# EAGLE schematic UhrV1.1 (EAGLE 5.11)

## Sheet 1 of 3
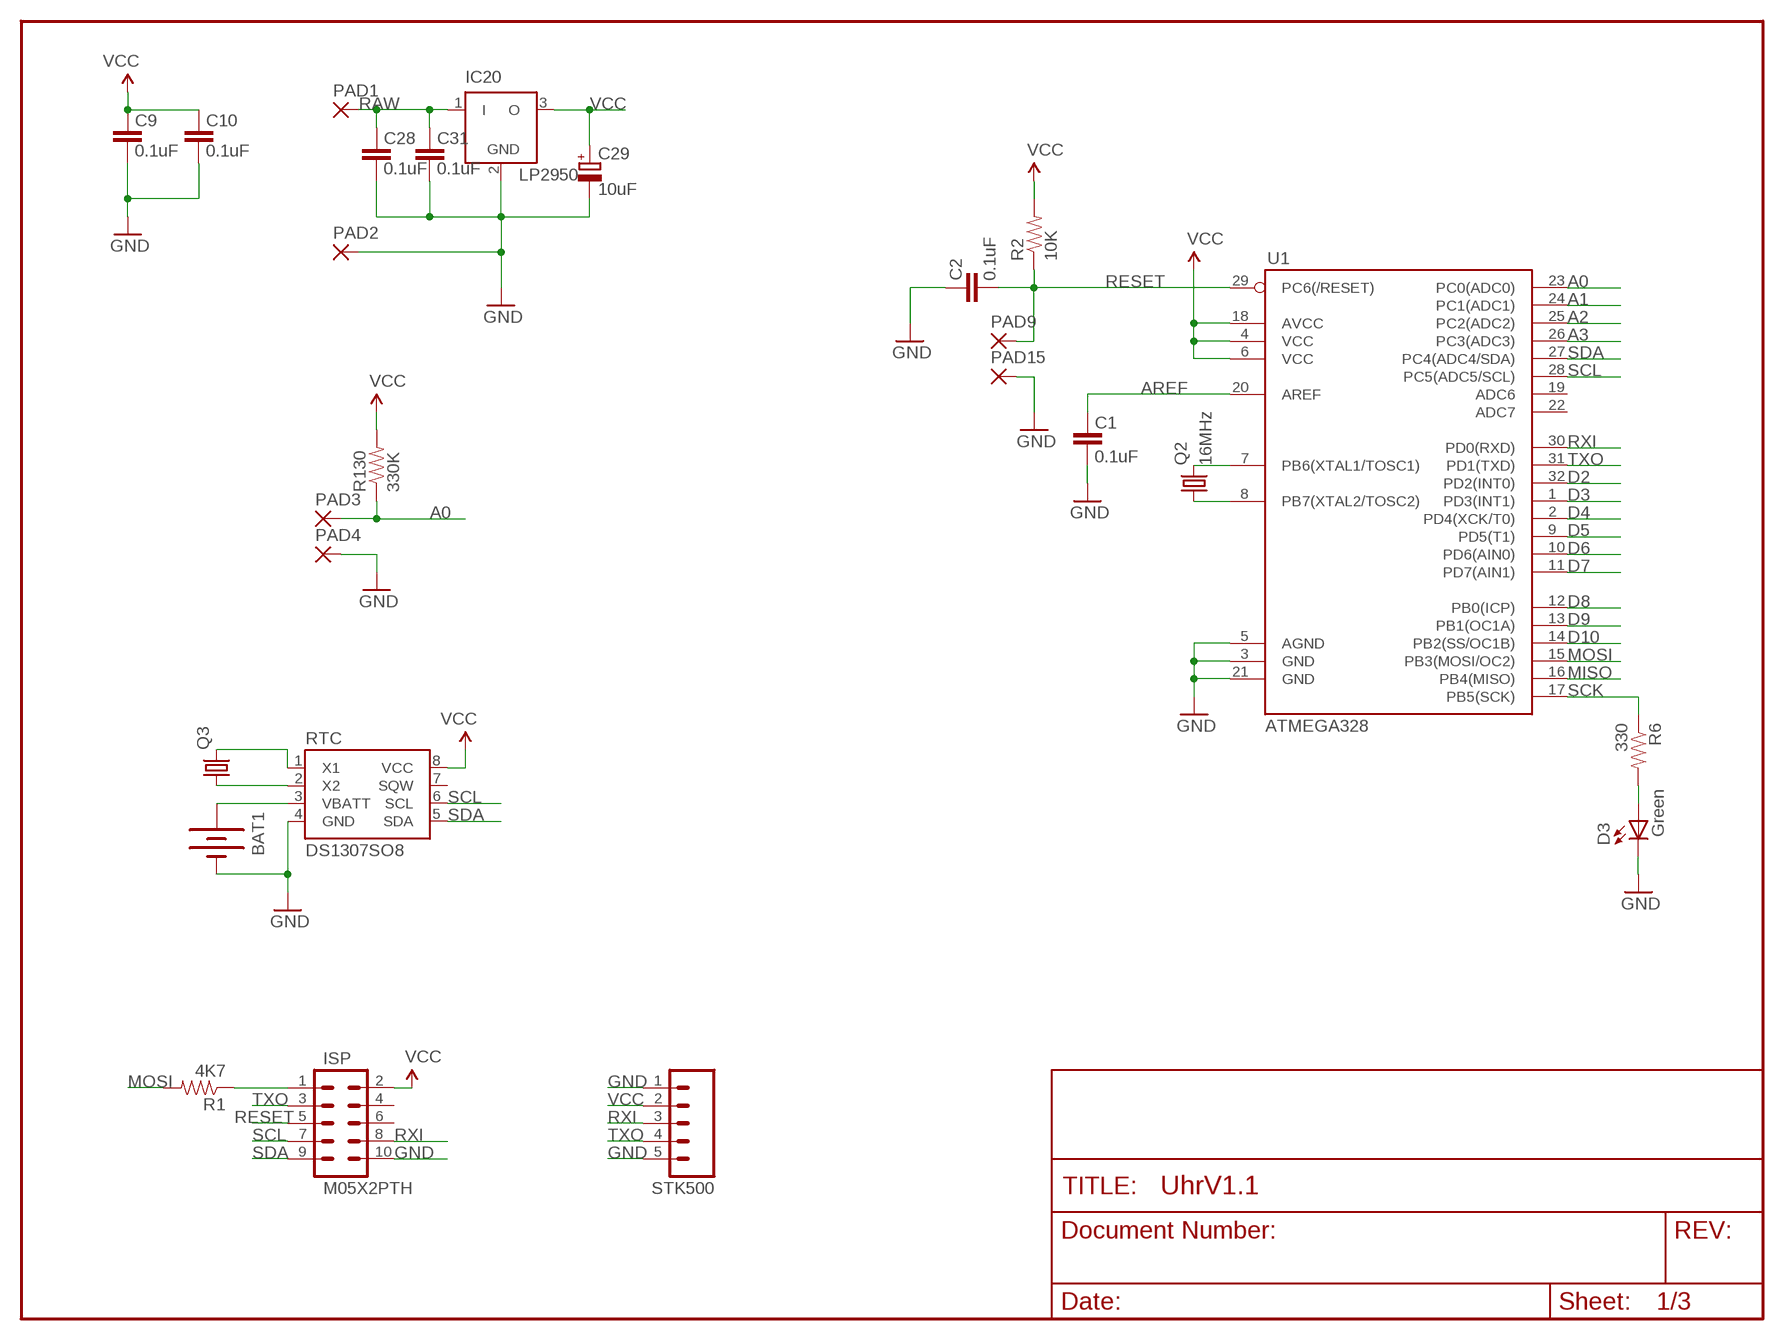
[diagram p0: schematic, sheet 1]

### Parts
BAT1  BATTERY12MM  [BATTCON_12MM]
C1  0.1uF  CAP0805  [0805]
C2  0.1uF  CAP0805  [0805]
C9  0.1uF  CAP0805  [0805]
C10  0.1uF  CAP0805  [0805]
C28  0.1uF  CAP0805  [0805]
C29  10uF  CPOL-EUB  [PANASONIC_B]
C31  0.1uF  CAP0805  [0805]
D3  Green  LED0603  [LED-0603]
IC20  LP2950  [DPACK]
ISP  M05X2PTH  [AVR_ICSP]
PAD1  SMD5  [SMD2,54-5,08]
PAD2  SMD5  [SMD2,54-5,08]
PAD3  SMD2  [SMD1,27-2,54]
PAD4  SMD2  [SMD1,27-2,54]
PAD9  SMD2  [SMD1,27-2,54]
PAD15  SMD2  [SMD1,27-2,54]
Q2  16MHz  CRYSTALHC49UP  [HC49UP]
Q3  CRYSTALTC38H  [TC38H]
R1  4K7  RESISTOR0805-RES  [0805]
R2  10K  RESISTOR0805-RES  [0805]
R6  330  RESISTOR0805-RES  [0805]
R130  330K  RESISTOR0805-RES  [0805]
RTC  DS1307SO8  [SO08]
STK500  M05PTH  [1X05]
U1  ATMEGA328  ATMEGA168  [TQFP32-08]

### Nets
A0: PAD3.1(P) R130.1 U1.23(PC0(ADC0))
A1: U1.24(PC1(ADC1))
A2: U1.25(PC2(ADC2))
A3: U1.26(PC3(ADC3))
AREF: C1.2 U1.20(AREF)
D2: U1.32(PD2(INT0)) ; also sheet 2
D3: U1.1(PD3(INT1)) ; also sheet 2
D4: U1.2(PD4(XCK/T0)) ; also sheet 2
D5: U1.9(PD5(T1)) ; also sheet 2
D6: U1.10(PD6(AIN0)) ; also sheet 3
D7: U1.11(PD7(AIN1)) ; also sheet 3
D8: U1.12(PB0(ICP)) ; also sheet 3
D9: U1.13(PB1(OC1A)) ; also sheet 3
D10: U1.14(PB2(SS/OC1B))
GND [supply]: BAT1.GND(-) C1.1 C2.2 C9.1 C10.1 C28.1 C29.- C31.1 D3.C IC20.2(GND) ISP.10 PAD2.1(P) PAD4.1(P) PAD15.1(P) RTC.4(GND) STK500.1 STK500.5 U1.3(GND) U1.5(AGND) U1.21(GND) ; also sheet 2,3
MISO: U1.16(PB4(MISO))
MOSI: R1.2 U1.15(PB3(MOSI/OC2))
N$1: Q2.1 U1.8(PB7(XTAL2/TOSC2))
N$2: Q2.2 U1.7(PB6(XTAL1/TOSC1))
N$3: ISP.1 R1.1
N$4: Q3.1 RTC.2(X2)
N$5: Q3.2 RTC.1(X1)
N$6: BAT1.PWR@1(+) RTC.3(VBATT)
N$7: D3.A R6.2
RAW [supply]: C28.2 C31.2 IC20.1(I) PAD1.1(P)
RESET: C2.1 ISP.5 PAD9.1(P) R2.1 U1.29(PC6(/RESET))
RXI: ISP.8 STK500.3 U1.30(PD0(RXD))
SCK: R6.1 U1.17(PB5(SCK))
SCL: ISP.7 RTC.6(SCL) U1.28(PC5(ADC5/SCL))
SDA: ISP.9 RTC.5(SDA) U1.27(PC4(ADC4/SDA))
TXO: ISP.3 STK500.4 U1.31(PD1(TXD))
VCC [supply]: C9.2 C10.2 C29.+ IC20.3(O) ISP.2 R2.2 R130.2 RTC.8(VCC) STK500.2 U1.4(VCC) U1.6(VCC) U1.18(AVCC) ; also sheet 2,3
Unconnected: ISP.4 ISP.6 RTC.7(SQW) U1.19(ADC6) U1.22(ADC7)

## Sheet 2 of 3
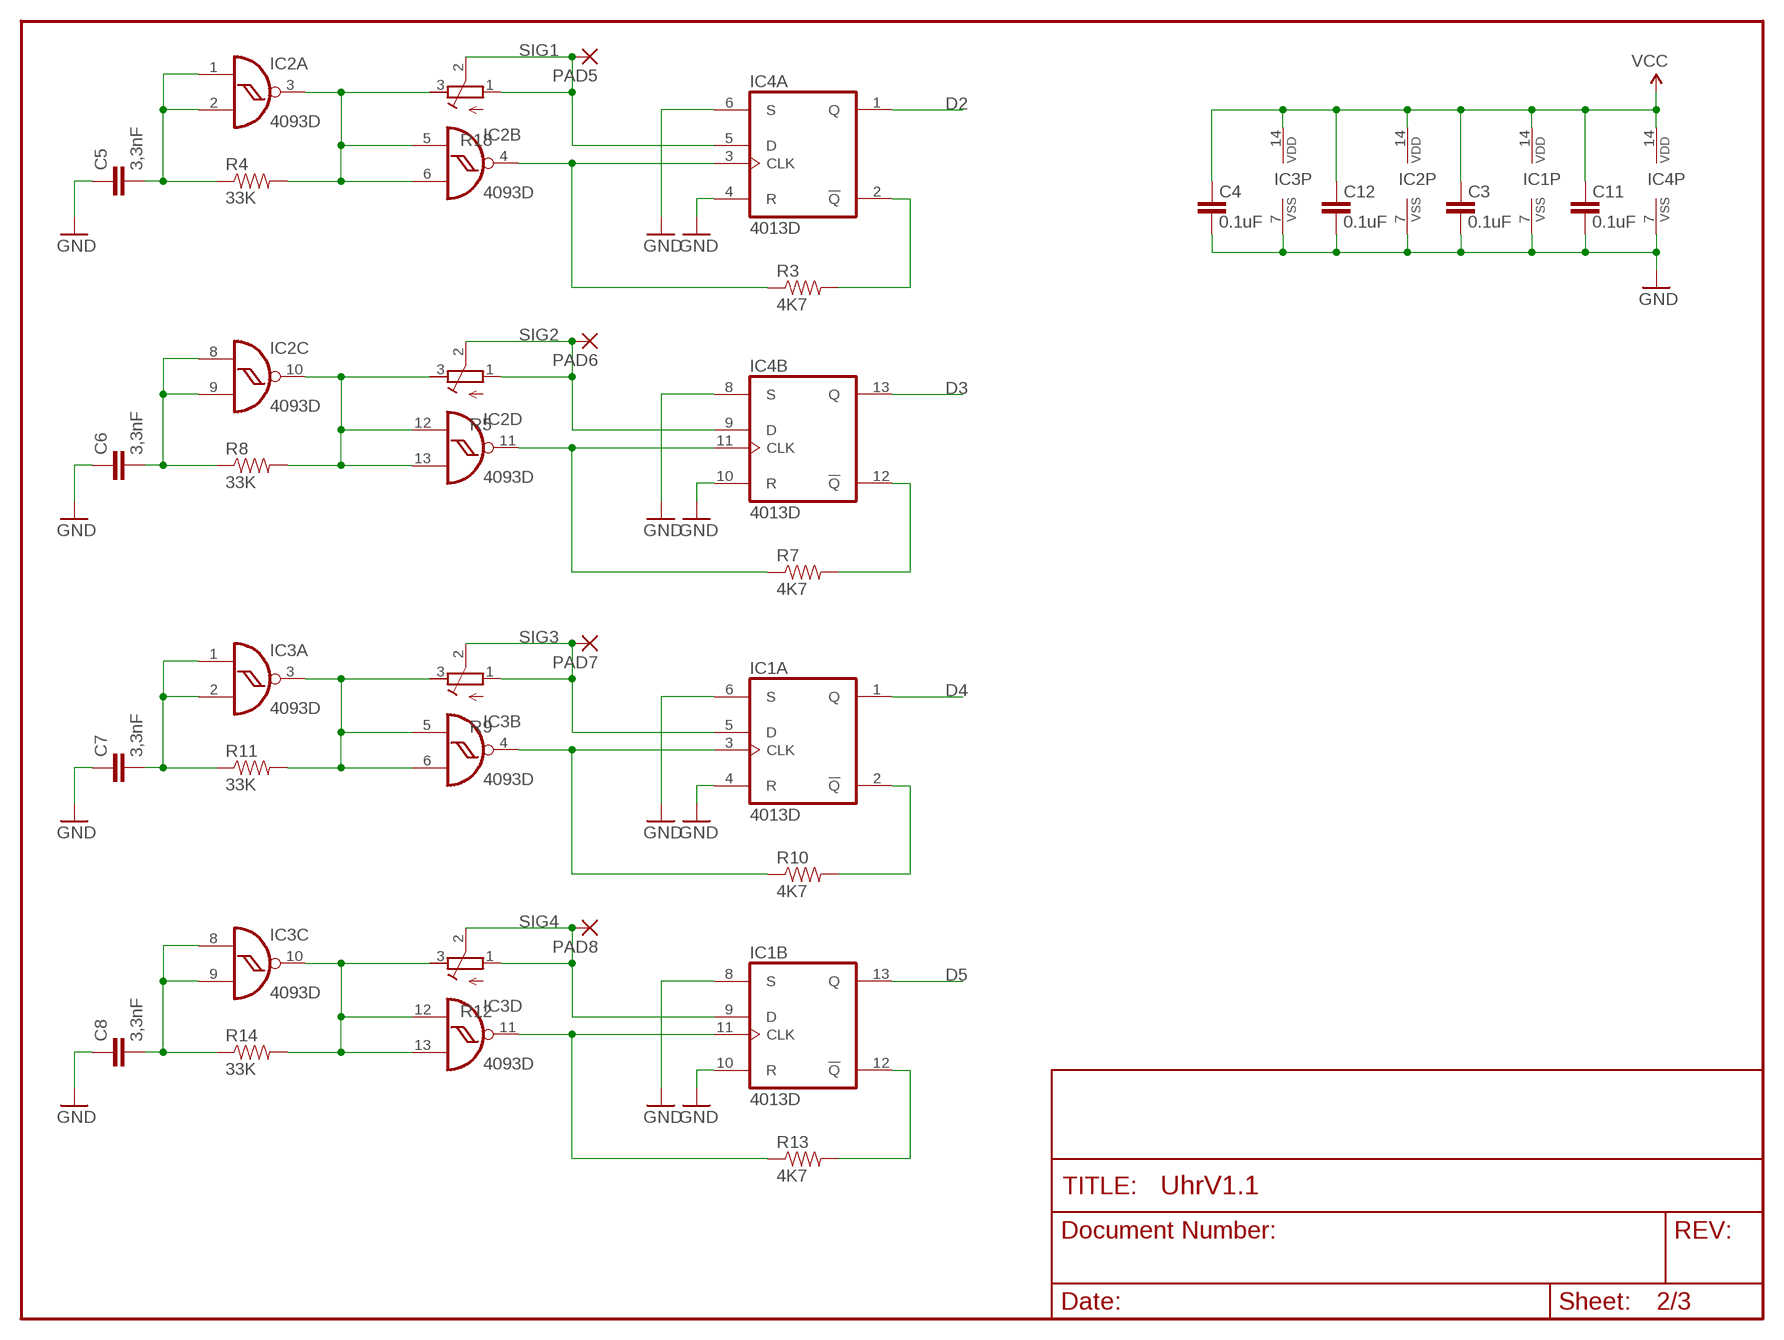
[diagram p1: schematic, sheet 2]

### Parts
C3  0.1uF  CAP0805  [0805]
C4  0.1uF  CAP0805  [0805]
C5  3,3nF  CAP0805  [0805]
C6  3,3nF  CAP0805  [0805]
C7  3,3nF  CAP0805  [0805]
C8  3,3nF  CAP0805  [0805]
C11  0.1uF  CAP0805  [0805]
C12  0.1uF  CAP0805  [0805]
IC1  4013D  [SO14]
IC2  4093D  [SO14]
IC3  4093D  [SO14]
IC4  4013D  [SO14]
PAD5  SMD2  [SMD1,27-2,54]
PAD6  SMD2  [SMD1,27-2,54]
PAD7  SMD2  [SMD1,27-2,54]
PAD8  SMD2  [SMD1,27-2,54]
R3  4K7  RESISTOR0805-RES  [0805]
R4  33K  RESISTOR0805-RES  [0805]
R5  R-TRIMM3314J  [RTRIM3314J]
R7  4K7  RESISTOR0805-RES  [0805]
R8  33K  RESISTOR0805-RES  [0805]
R9  R-TRIMM3314J  [RTRIM3314J]
R10  4K7  RESISTOR0805-RES  [0805]
R11  33K  RESISTOR0805-RES  [0805]
R12  R-TRIMM3314J  [RTRIM3314J]
R13  4K7  RESISTOR0805-RES  [0805]
R14  33K  RESISTOR0805-RES  [0805]
R18  R-TRIMM3314J  [RTRIM3314J]

### Nets
D2: IC4.1(A:Q) ; also sheet 1
D3: IC4.13(B:Q) ; also sheet 1
D4: IC1.1(A:Q) ; also sheet 1
D5: IC1.13(B:Q) ; also sheet 1
GND [supply]: C3.1 C4.1 C5.1 C6.1 C7.1 C8.1 C11.1 C12.1 IC1.4(A:R) IC1.6(A:S) IC1.7(P:VSS) IC1.8(B:S) IC1.10(B:R) IC2.7(P:VSS) IC3.7(P:VSS) IC4.4(A:R) IC4.6(A:S) IC4.7(P:VSS) IC4.8(B:S) IC4.10(B:R) ; also sheet 1,3
N$8: IC2.4(B:O) IC4.3(A:CLK) R3.1
N$9: IC4.2(A:!Q) R3.2
N$11: IC2.3(A:O) IC2.5(B:I0) IC2.6(B:I1) R4.2 R18.3(A)
N$12: IC1.3(A:CLK) IC3.4(B:O) R10.1
N$13: C5.2 IC2.1(A:I0) IC2.2(A:I1) R4.1
N$15: IC2.11(D:O) IC4.11(B:CLK) R7.1
N$16: IC4.12(B:!Q) R7.2
N$17: IC2.10(C:O) IC2.12(D:I0) IC2.13(D:I1) R5.3(A) R8.2
N$18: C6.2 IC2.8(C:I0) IC2.9(C:I1) R8.1
N$21: IC1.2(A:!Q) R10.2
N$22: IC3.3(A:O) IC3.5(B:I0) IC3.6(B:I1) R9.3(A) R11.2
N$23: C7.2 IC3.1(A:I0) IC3.2(A:I1) R11.1
N$26: IC1.11(B:CLK) IC3.11(D:O) R13.1
N$27: IC1.12(B:!Q) R13.2
N$28: IC3.10(C:O) IC3.12(D:I0) IC3.13(D:I1) R12.3(A) R14.2
N$29: C8.2 IC3.8(C:I0) IC3.9(C:I1) R14.1
SIG1: IC4.5(A:D) PAD5.1(P) R18.1(E) R18.2(S)
SIG2: IC4.9(B:D) PAD6.1(P) R5.1(E) R5.2(S)
SIG3: IC1.5(A:D) PAD7.1(P) R9.1(E) R9.2(S)
SIG4: IC1.9(B:D) PAD8.1(P) R12.1(E) R12.2(S)
VCC [supply]: C3.2 C4.2 C11.2 C12.2 IC1.14(P:VDD) IC2.14(P:VDD) IC3.14(P:VDD) IC4.14(P:VDD) ; also sheet 1,3

## Sheet 3 of 3
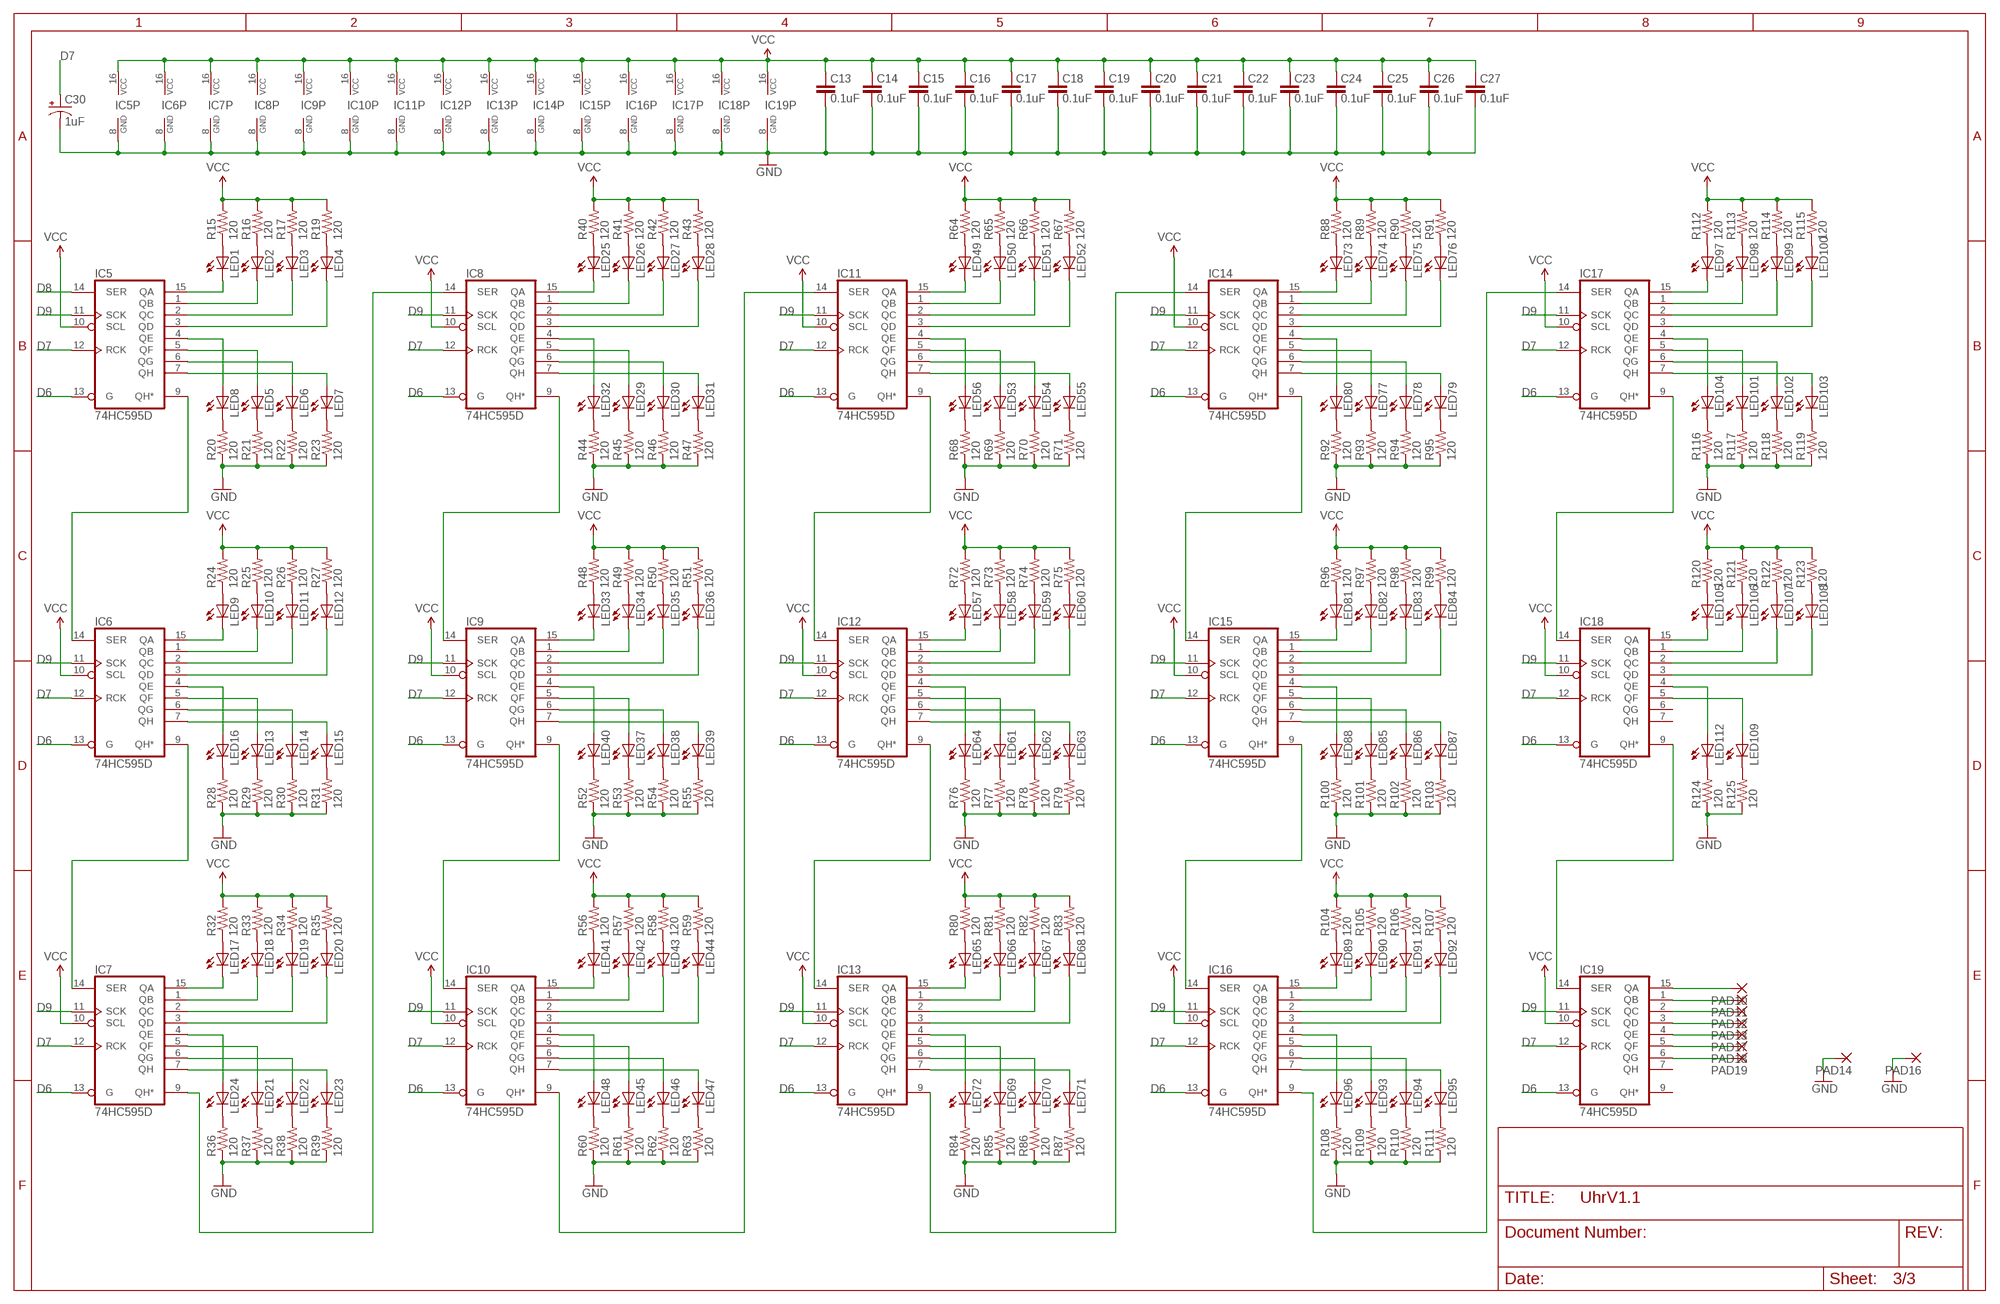
[diagram p2: schematic, sheet 3]

### Parts
C13  0.1uF  CAP0805  [0805]
C14  0.1uF  CAP0805  [0805]
C15  0.1uF  CAP0805  [0805]
C16  0.1uF  CAP0805  [0805]
C17  0.1uF  CAP0805  [0805]
C18  0.1uF  CAP0805  [0805]
C19  0.1uF  CAP0805  [0805]
C20  0.1uF  CAP0805  [0805]
C21  0.1uF  CAP0805  [0805]
C22  0.1uF  CAP0805  [0805]
C23  0.1uF  CAP0805  [0805]
C24  0.1uF  CAP0805  [0805]
C25  0.1uF  CAP0805  [0805]
C26  0.1uF  CAP0805  [0805]
C27  0.1uF  CAP0805  [0805]
C30  1uF  CAP_POL1206  [EIA3216]
IC5  74HC595D  [SO16]
IC6  74HC595D  [SO16]
IC7  74HC595D  [SO16]
IC8  74HC595D  [SO16]
IC9  74HC595D  [SO16]
IC10  74HC595D  [SO16]
IC11  74HC595D  [SO16]
IC12  74HC595D  [SO16]
IC13  74HC595D  [SO16]
IC14  74HC595D  [SO16]
IC15  74HC595D  [SO16]
IC16  74HC595D  [SO16]
IC17  74HC595D  [SO16]
IC18  74HC595D  [SO16]
IC19  74HC595D  [SO16]
LED1  LEDSMT1206  [1206]
LED2  LEDSMT1206  [1206]
LED3  LEDSMT1206  [1206]
LED4  LEDSMT1206  [1206]
LED5  LEDSMT1206  [1206]
LED6  LEDSMT1206  [1206]
LED7  LEDSMT1206  [1206]
LED8  LEDSMT1206  [1206]
LED9  LEDSMT1206  [1206]
LED10  LEDSMT1206  [1206]
LED11  LEDSMT1206  [1206]
LED12  LEDSMT1206  [1206]
LED13  LEDSMT1206  [1206]
LED14  LEDSMT1206  [1206]
LED15  LEDSMT1206  [1206]
LED16  LEDSMT1206  [1206]
LED17  LEDSMT1206  [1206]
LED18  LEDSMT1206  [1206]
LED19  LEDSMT1206  [1206]
LED20  LEDSMT1206  [1206]
LED21  LEDSMT1206  [1206]
LED22  LEDSMT1206  [1206]
LED23  LEDSMT1206  [1206]
LED24  LEDSMT1206  [1206]
LED25  LEDSMT1206  [1206]
LED26  LEDSMT1206  [1206]
LED27  LEDSMT1206  [1206]
LED28  LEDSMT1206  [1206]
LED29  LEDSMT1206  [1206]
LED30  LEDSMT1206  [1206]
LED31  LEDSMT1206  [1206]
LED32  LEDSMT1206  [1206]
LED33  LEDSMT1206  [1206]
LED34  LEDSMT1206  [1206]
LED35  LEDSMT1206  [1206]
LED36  LEDSMT1206  [1206]
LED37  LEDSMT1206  [1206]
LED38  LEDSMT1206  [1206]
LED39  LEDSMT1206  [1206]
LED40  LEDSMT1206  [1206]
LED41  LEDSMT1206  [1206]
LED42  LEDSMT1206  [1206]
LED43  LEDSMT1206  [1206]
LED44  LEDSMT1206  [1206]
LED45  LEDSMT1206  [1206]
LED46  LEDSMT1206  [1206]
LED47  LEDSMT1206  [1206]
LED48  LEDSMT1206  [1206]
LED49  LEDSMT1206  [1206]
LED50  LEDSMT1206  [1206]
LED51  LEDSMT1206  [1206]
LED52  LEDSMT1206  [1206]
LED53  LEDSMT1206  [1206]
LED54  LEDSMT1206  [1206]
LED55  LEDSMT1206  [1206]
LED56  LEDSMT1206  [1206]
LED57  LEDSMT1206  [1206]
LED58  LEDSMT1206  [1206]
LED59  LEDSMT1206  [1206]
LED60  LEDSMT1206  [1206]
LED61  LEDSMT1206  [1206]
LED62  LEDSMT1206  [1206]
LED63  LEDSMT1206  [1206]
LED64  LEDSMT1206  [1206]
LED65  LEDSMT1206  [1206]
LED66  LEDSMT1206  [1206]
LED67  LEDSMT1206  [1206]
LED68  LEDSMT1206  [1206]
LED69  LEDSMT1206  [1206]
LED70  LEDSMT1206  [1206]
LED71  LEDSMT1206  [1206]
LED72  LEDSMT1206  [1206]
LED73  LEDSMT1206  [1206]
LED74  LEDSMT1206  [1206]
LED75  LEDSMT1206  [1206]
LED76  LEDSMT1206  [1206]
LED77  LEDSMT1206  [1206]
LED78  LEDSMT1206  [1206]
LED79  LEDSMT1206  [1206]
LED80  LEDSMT1206  [1206]
LED81  LEDSMT1206  [1206]
LED82  LEDSMT1206  [1206]
LED83  LEDSMT1206  [1206]
LED84  LEDSMT1206  [1206]
LED85  LEDSMT1206  [1206]
LED86  LEDSMT1206  [1206]
LED87  LEDSMT1206  [1206]
LED88  LEDSMT1206  [1206]
LED89  LEDSMT1206  [1206]
LED90  LEDSMT1206  [1206]
LED91  LEDSMT1206  [1206]
LED92  LEDSMT1206  [1206]
LED93  LEDSMT1206  [1206]
LED94  LEDSMT1206  [1206]
LED95  LEDSMT1206  [1206]
LED96  LEDSMT1206  [1206]
LED97  LEDSMT1206  [1206]
LED98  LEDSMT1206  [1206]
LED99  LEDSMT1206  [1206]
LED100  LEDSMT1206  [1206]
LED101  LEDSMT1206  [1206]
LED102  LEDSMT1206  [1206]
LED103  LEDSMT1206  [1206]
LED104  LEDSMT1206  [1206]
LED105  LEDSMT1206  [1206]
LED106  LEDSMT1206  [1206]
LED107  LEDSMT1206  [1206]
LED108  LEDSMT1206  [1206]
LED109  LEDSMT1206  [1206]
LED112  LEDSMT1206  [1206]
PAD10  SMD2  [SMD1,27-2,54]
PAD11  SMD2  [SMD1,27-2,54]
PAD12  SMD2  [SMD1,27-2,54]
PAD13  SMD2  [SMD1,27-2,54]
PAD14  SMD2  [SMD1,27-2,54]
PAD16  SMD2  [SMD1,27-2,54]
PAD17  SMD2  [SMD1,27-2,54]
PAD18  SMD2  [SMD1,27-2,54]
PAD19  SMD2  [SMD1,27-2,54]
R15  120  RESISTOR0805-RES  [0805]
R16  120  RESISTOR0805-RES  [0805]
R17  120  RESISTOR0805-RES  [0805]
R19  120  RESISTOR0805-RES  [0805]
R20  120  RESISTOR0805-RES  [0805]
R21  120  RESISTOR0805-RES  [0805]
R22  120  RESISTOR0805-RES  [0805]
R23  120  RESISTOR0805-RES  [0805]
R24  120  RESISTOR0805-RES  [0805]
R25  120  RESISTOR0805-RES  [0805]
R26  120  RESISTOR0805-RES  [0805]
R27  120  RESISTOR0805-RES  [0805]
R28  120  RESISTOR0805-RES  [0805]
R29  120  RESISTOR0805-RES  [0805]
R30  120  RESISTOR0805-RES  [0805]
R31  120  RESISTOR0805-RES  [0805]
R32  120  RESISTOR0805-RES  [0805]
R33  120  RESISTOR0805-RES  [0805]
R34  120  RESISTOR0805-RES  [0805]
R35  120  RESISTOR0805-RES  [0805]
R36  120  RESISTOR0805-RES  [0805]
R37  120  RESISTOR0805-RES  [0805]
R38  120  RESISTOR0805-RES  [0805]
R39  120  RESISTOR0805-RES  [0805]
R40  120  RESISTOR0805-RES  [0805]
R41  120  RESISTOR0805-RES  [0805]
R42  120  RESISTOR0805-RES  [0805]
R43  120  RESISTOR0805-RES  [0805]
R44  120  RESISTOR0805-RES  [0805]
R45  120  RESISTOR0805-RES  [0805]
R46  120  RESISTOR0805-RES  [0805]
R47  120  RESISTOR0805-RES  [0805]
R48  120  RESISTOR0805-RES  [0805]
R49  120  RESISTOR0805-RES  [0805]
R50  120  RESISTOR0805-RES  [0805]
R51  120  RESISTOR0805-RES  [0805]
R52  120  RESISTOR0805-RES  [0805]
R53  120  RESISTOR0805-RES  [0805]
R54  120  RESISTOR0805-RES  [0805]
R55  120  RESISTOR0805-RES  [0805]
R56  120  RESISTOR0805-RES  [0805]
R57  120  RESISTOR0805-RES  [0805]
R58  120  RESISTOR0805-RES  [0805]
R59  120  RESISTOR0805-RES  [0805]
R60  120  RESISTOR0805-RES  [0805]
R61  120  RESISTOR0805-RES  [0805]
R62  120  RESISTOR0805-RES  [0805]
R63  120  RESISTOR0805-RES  [0805]
R64  120  RESISTOR0805-RES  [0805]
R65  120  RESISTOR0805-RES  [0805]
R66  120  RESISTOR0805-RES  [0805]
R67  120  RESISTOR0805-RES  [0805]
R68  120  RESISTOR0805-RES  [0805]
R69  120  RESISTOR0805-RES  [0805]
R70  120  RESISTOR0805-RES  [0805]
R71  120  RESISTOR0805-RES  [0805]
R72  120  RESISTOR0805-RES  [0805]
R73  120  RESISTOR0805-RES  [0805]
R74  120  RESISTOR0805-RES  [0805]
R75  120  RESISTOR0805-RES  [0805]
R76  120  RESISTOR0805-RES  [0805]
R77  120  RESISTOR0805-RES  [0805]
R78  120  RESISTOR0805-RES  [0805]
R79  120  RESISTOR0805-RES  [0805]
R80  120  RESISTOR0805-RES  [0805]
R81  120  RESISTOR0805-RES  [0805]
R82  120  RESISTOR0805-RES  [0805]
R83  120  RESISTOR0805-RES  [0805]
R84  120  RESISTOR0805-RES  [0805]
R85  120  RESISTOR0805-RES  [0805]
R86  120  RESISTOR0805-RES  [0805]
R87  120  RESISTOR0805-RES  [0805]
R88  120  RESISTOR0805-RES  [0805]
R89  120  RESISTOR0805-RES  [0805]
R90  120  RESISTOR0805-RES  [0805]
R91  120  RESISTOR0805-RES  [0805]
R92  120  RESISTOR0805-RES  [0805]
R93  120  RESISTOR0805-RES  [0805]
R94  120  RESISTOR0805-RES  [0805]
R95  120  RESISTOR0805-RES  [0805]
R96  120  RESISTOR0805-RES  [0805]
R97  120  RESISTOR0805-RES  [0805]
R98  120  RESISTOR0805-RES  [0805]
R99  120  RESISTOR0805-RES  [0805]
R100  120  RESISTOR0805-RES  [0805]
R101  120  RESISTOR0805-RES  [0805]
R102  120  RESISTOR0805-RES  [0805]
R103  120  RESISTOR0805-RES  [0805]
R104  120  RESISTOR0805-RES  [0805]
R105  120  RESISTOR0805-RES  [0805]
R106  120  RESISTOR0805-RES  [0805]
R107  120  RESISTOR0805-RES  [0805]
R108  120  RESISTOR0805-RES  [0805]
R109  120  RESISTOR0805-RES  [0805]
R110  120  RESISTOR0805-RES  [0805]
R111  120  RESISTOR0805-RES  [0805]
R112  120  RESISTOR0805-RES  [0805]
R113  120  RESISTOR0805-RES  [0805]
R114  120  RESISTOR0805-RES  [0805]
R115  120  RESISTOR0805-RES  [0805]
R116  120  RESISTOR0805-RES  [0805]
R117  120  RESISTOR0805-RES  [0805]
R118  120  RESISTOR0805-RES  [0805]
R119  120  RESISTOR0805-RES  [0805]
R120  120  RESISTOR0805-RES  [0805]
R121  120  RESISTOR0805-RES  [0805]
R122  120  RESISTOR0805-RES  [0805]
R123  120  RESISTOR0805-RES  [0805]
R124  120  RESISTOR0805-RES  [0805]
R125  120  RESISTOR0805-RES  [0805]

### Nets
D6: IC5.13(G) IC6.13(G) IC7.13(G) IC8.13(G) IC9.13(G) IC10.13(G) IC11.13(G) IC12.13(G) IC13.13(G) IC14.13(G) IC15.13(G) IC16.13(G) IC17.13(G) IC18.13(G) IC19.13(G) ; also sheet 1
D7: C30.A(+) IC5.12(RCK) IC6.12(RCK) IC7.12(RCK) IC8.12(RCK) IC9.12(RCK) IC10.12(RCK) IC11.12(RCK) IC12.12(RCK) IC13.12(RCK) IC14.12(RCK) IC15.12(RCK) IC16.12(RCK) IC17.12(RCK) IC18.12(RCK) IC19.12(RCK) ; also sheet 1
D8: IC5.14(SER) ; also sheet 1
D9: IC5.11(SCK) IC6.11(SCK) IC7.11(SCK) IC8.11(SCK) IC9.11(SCK) IC10.11(SCK) IC11.11(SCK) IC12.11(SCK) IC13.11(SCK) IC14.11(SCK) IC15.11(SCK) IC16.11(SCK) IC17.11(SCK) IC18.11(SCK) IC19.11(SCK) ; also sheet 1
GND [supply]: C13.1 C14.1 C15.1 C16.1 C17.1 C18.1 C19.1 C20.1 C21.1 C22.1 C23.1 C24.1 C25.1 C26.1 C27.1 C30.C(-) IC5.8(GND) IC6.8(GND) IC7.8(GND) IC8.8(GND) IC9.8(GND) IC10.8(GND) IC11.8(GND) IC12.8(GND) IC13.8(GND) IC14.8(GND) IC15.8(GND) IC16.8(GND) IC17.8(GND) IC18.8(GND) IC19.8(GND) PAD14.1(P) PAD16.1(P) R20.1 R21.1 R22.1 R23.1 R28.1 R29.1 R30.1 R31.1 R36.1 R37.1 R38.1 R39.1 R44.1 R45.1 R46.1 R47.1 R52.1 R53.1 R54.1 R55.1 R60.1 R61.1 R62.1 R63.1 R68.1 R69.1 R70.1 R71.1 R76.1 R77.1 R78.1 R79.1 R84.1 R85.1 R86.1 R87.1 R92.1 R93.1 R94.1 R95.1 R100.1 R101.1 R102.1 R103.1 R108.1 R109.1 R110.1 R111.1 R116.1 R117.1 R118.1 R119.1 R124.1 R125.1 ; also sheet 1,2
N$10: LED1.A R15.1
N$14: IC13.9(QH*) IC14.14(SER)
N$19: LED2.A R16.1
N$20: IC19.15(QA) PAD10.1(P)
N$24: LED3.A R17.1
N$25: IC19.1(QB) PAD11.1(P)
N$30: LED4.A R19.1
N$31: IC19.2(QC) PAD12.1(P)
N$32: LED8.C R20.2
N$33: LED5.C R21.2
N$34: LED6.C R22.2
N$35: LED7.C R23.2
N$36: IC5.15(QA) LED1.C
N$37: IC5.1(QB) LED2.C
N$38: IC5.2(QC) LED3.C
N$39: IC5.3(QD) LED4.C
N$40: IC5.4(QE) LED8.A
N$41: IC5.5(QF) LED5.A
N$42: IC5.6(QG) LED6.A
N$43: IC5.7(QH) LED7.A
N$44: IC19.3(QD) PAD13.1(P)
N$45: LED9.A R24.1
N$46: LED10.A R25.1
N$47: LED11.A R26.1
N$48: LED12.A R27.1
N$49: LED16.C R28.2
N$50: LED13.C R29.2
N$51: LED14.C R30.2
N$52: LED15.C R31.2
N$53: IC6.15(QA) LED9.C
N$54: IC6.1(QB) LED10.C
N$55: IC6.2(QC) LED11.C
N$56: IC6.3(QD) LED12.C
N$57: IC6.4(QE) LED16.A
N$58: IC6.5(QF) LED13.A
N$59: IC6.6(QG) LED14.A
N$60: IC6.7(QH) LED15.A
N$61: IC5.9(QH*) IC6.14(SER)
N$62: LED17.A R32.1
N$63: LED18.A R33.1
N$64: LED19.A R34.1
N$65: LED20.A R35.1
N$66: LED24.C R36.2
N$67: LED21.C R37.2
N$68: LED22.C R38.2
N$69: LED23.C R39.2
N$70: IC7.15(QA) LED17.C
N$71: IC7.1(QB) LED18.C
N$72: IC7.2(QC) LED19.C
N$73: IC7.3(QD) LED20.C
N$74: IC7.4(QE) LED24.A
N$75: IC7.5(QF) LED21.A
N$76: IC7.6(QG) LED22.A
N$77: IC7.7(QH) LED23.A
N$78: IC6.9(QH*) IC7.14(SER)
N$79: LED25.A R40.1
N$80: LED26.A R41.1
N$81: LED27.A R42.1
N$82: LED28.A R43.1
N$83: LED32.C R44.2
N$84: LED29.C R45.2
N$85: LED30.C R46.2
N$86: LED31.C R47.2
N$87: IC8.15(QA) LED25.C
N$88: IC8.1(QB) LED26.C
N$89: IC8.2(QC) LED27.C
N$90: IC8.3(QD) LED28.C
N$91: IC8.4(QE) LED32.A
N$92: IC8.5(QF) LED29.A
N$93: IC8.6(QG) LED30.A
N$94: IC8.7(QH) LED31.A
N$95: IC7.9(QH*) IC8.14(SER)
N$96: LED33.A R48.1
N$97: LED34.A R49.1
N$98: LED35.A R50.1
N$99: LED36.A R51.1
N$100: LED40.C R52.2
N$101: LED37.C R53.2
N$102: LED38.C R54.2
N$103: LED39.C R55.2
N$104: IC9.15(QA) LED33.C
N$105: IC9.1(QB) LED34.C
N$106: IC9.2(QC) LED35.C
N$107: IC9.3(QD) LED36.C
N$108: IC9.4(QE) LED40.A
N$109: IC9.5(QF) LED37.A
N$110: IC9.6(QG) LED38.A
N$111: IC9.7(QH) LED39.A
N$112: IC8.9(QH*) IC9.14(SER)
N$113: LED41.A R56.1
N$114: LED42.A R57.1
N$115: LED43.A R58.1
N$116: LED44.A R59.1
N$117: LED48.C R60.2
N$118: LED45.C R61.2
N$119: LED46.C R62.2
N$120: LED47.C R63.2
N$121: IC10.15(QA) LED41.C
N$122: IC10.1(QB) LED42.C
N$123: IC10.2(QC) LED43.C
N$124: IC10.3(QD) LED44.C
N$125: IC10.4(QE) LED48.A
N$126: IC10.5(QF) LED45.A
N$127: IC10.6(QG) LED46.A
N$128: IC10.7(QH) LED47.A
N$129: IC9.9(QH*) IC10.14(SER)
N$130: LED49.A R64.1
N$131: LED50.A R65.1
N$132: LED51.A R66.1
N$133: LED52.A R67.1
N$134: LED56.C R68.2
N$135: LED53.C R69.2
N$136: LED54.C R70.2
N$137: LED55.C R71.2
N$138: IC11.15(QA) LED49.C
N$139: IC11.1(QB) LED50.C
N$140: IC11.2(QC) LED51.C
N$141: IC11.3(QD) LED52.C
N$142: IC11.4(QE) LED56.A
N$143: IC11.5(QF) LED53.A
N$144: IC11.6(QG) LED54.A
N$145: IC11.7(QH) LED55.A
N$146: LED57.A R72.1
N$147: LED58.A R73.1
N$148: LED59.A R74.1
N$149: LED60.A R75.1
N$150: LED64.C R76.2
N$151: LED61.C R77.2
N$152: LED62.C R78.2
N$153: LED63.C R79.2
N$154: IC12.15(QA) LED57.C
N$155: IC12.1(QB) LED58.C
N$156: IC12.2(QC) LED59.C
N$157: IC12.3(QD) LED60.C
N$158: IC12.4(QE) LED64.A
N$159: IC12.5(QF) LED61.A
N$160: IC12.6(QG) LED62.A
N$161: IC12.7(QH) LED63.A
N$162: IC11.9(QH*) IC12.14(SER)
N$163: LED65.A R80.1
N$164: LED66.A R81.1
N$165: LED67.A R82.1
N$166: LED68.A R83.1
N$167: LED72.C R84.2
N$168: LED69.C R85.2
N$169: LED70.C R86.2
N$170: LED71.C R87.2
N$171: IC13.15(QA) LED65.C
N$172: IC13.1(QB) LED66.C
N$173: IC13.2(QC) LED67.C
N$174: IC13.3(QD) LED68.C
N$175: IC13.4(QE) LED72.A
N$176: IC13.5(QF) LED69.A
N$177: IC13.6(QG) LED70.A
N$178: IC13.7(QH) LED71.A
N$179: IC10.9(QH*) IC11.14(SER)
N$180: LED73.A R88.1
N$181: IC12.9(QH*) IC13.14(SER)
N$182: LED74.A R89.1
N$183: LED75.A R90.1
N$184: LED76.A R91.1
N$185: LED80.C R92.2
N$186: LED77.C R93.2
N$187: LED78.C R94.2
N$188: LED79.C R95.2
N$189: IC14.15(QA) LED73.C
N$190: IC14.1(QB) LED74.C
N$191: IC14.2(QC) LED75.C
N$192: IC14.3(QD) LED76.C
N$193: IC14.4(QE) LED80.A
N$194: IC14.5(QF) LED77.A
N$195: IC14.6(QG) LED78.A
N$196: IC14.7(QH) LED79.A
N$197: LED81.A R96.1
N$198: LED82.A R97.1
N$199: LED83.A R98.1
N$200: LED84.A R99.1
N$201: LED88.C R100.2
N$202: LED85.C R101.2
N$203: LED86.C R102.2
N$204: LED87.C R103.2
N$205: IC15.15(QA) LED81.C
N$206: IC15.1(QB) LED82.C
N$207: IC15.2(QC) LED83.C
N$208: IC15.3(QD) LED84.C
N$209: IC15.4(QE) LED88.A
N$210: IC15.5(QF) LED85.A
N$211: IC15.6(QG) LED86.A
N$212: IC15.7(QH) LED87.A
N$213: IC14.9(QH*) IC15.14(SER)
N$214: LED89.A R104.1
N$215: LED90.A R105.1
N$216: LED91.A R106.1
N$217: LED92.A R107.1
N$218: LED96.C R108.2
N$219: LED93.C R109.2
N$220: LED94.C R110.2
N$221: LED95.C R111.2
N$222: IC16.15(QA) LED89.C
N$223: IC16.1(QB) LED90.C
N$224: IC16.2(QC) LED91.C
N$225: IC16.3(QD) LED92.C
N$226: IC16.4(QE) LED96.A
N$227: IC16.5(QF) LED93.A
N$228: IC16.6(QG) LED94.A
N$229: IC16.7(QH) LED95.A
N$230: IC15.9(QH*) IC16.14(SER)
N$231: LED97.A R112.1
N$232: LED98.A R113.1
N$233: LED99.A R114.1
N$234: LED100.A R115.1
N$235: LED104.C R116.2
N$236: LED101.C R117.2
N$237: LED102.C R118.2
N$238: LED103.C R119.2
N$239: IC17.15(QA) LED97.C
N$240: IC17.1(QB) LED98.C
N$241: IC17.2(QC) LED99.C
N$242: IC17.3(QD) LED100.C
N$243: IC17.4(QE) LED104.A
N$244: IC17.5(QF) LED101.A
N$245: IC17.6(QG) LED102.A
N$246: IC17.7(QH) LED103.A
N$247: IC16.9(QH*) IC17.14(SER)
N$248: LED105.A R120.1
N$249: LED106.A R121.1
N$250: LED107.A R122.1
N$251: LED108.A R123.1
N$252: LED112.C R124.2
N$253: LED109.C R125.2
N$254: IC19.4(QE) PAD17.1(P)
N$255: IC19.5(QF) PAD18.1(P)
N$256: IC18.15(QA) LED105.C
N$257: IC18.1(QB) LED106.C
N$258: IC18.2(QC) LED107.C
N$259: IC18.3(QD) LED108.C
N$260: IC18.4(QE) LED112.A
N$261: IC18.5(QF) LED109.A
N$262: IC19.6(QG) PAD19.1(P)
N$280: IC17.9(QH*) IC18.14(SER)
N$281: IC18.9(QH*) IC19.14(SER)
VCC [supply]: C13.2 C14.2 C15.2 C16.2 C17.2 C18.2 C19.2 C20.2 C21.2 C22.2 C23.2 C24.2 C25.2 C26.2 C27.2 IC5.10(SCL) IC5.16(VCC) IC6.10(SCL) IC6.16(VCC) IC7.10(SCL) IC7.16(VCC) IC8.10(SCL) IC8.16(VCC) IC9.10(SCL) IC9.16(VCC) IC10.10(SCL) IC10.16(VCC) IC11.10(SCL) IC11.16(VCC) IC12.10(SCL) IC12.16(VCC) IC13.10(SCL) IC13.16(VCC) IC14.10(SCL) IC14.16(VCC) IC15.10(SCL) IC15.16(VCC) IC16.10(SCL) IC16.16(VCC) IC17.10(SCL) IC17.16(VCC) IC18.10(SCL) IC18.16(VCC) IC19.10(SCL) IC19.16(VCC) R15.2 R16.2 R17.2 R19.2 R24.2 R25.2 R26.2 R27.2 R32.2 R33.2 R34.2 R35.2 R40.2 R41.2 R42.2 R43.2 R48.2 R49.2 R50.2 R51.2 R56.2 R57.2 R58.2 R59.2 R64.2 R65.2 R66.2 R67.2 R72.2 R73.2 R74.2 R75.2 R80.2 R81.2 R82.2 R83.2 R88.2 R89.2 R90.2 R91.2 R96.2 R97.2 R98.2 R99.2 R104.2 R105.2 R106.2 R107.2 R112.2 R113.2 R114.2 R115.2 R120.2 R121.2 R122.2 R123.2 ; also sheet 1,2
Unconnected: IC18.6(QG) IC18.7(QH) IC19.7(QH) IC19.9(QH*)

## Library data of the parts
BAT1 = SparkFun:BATTERY: Battery Holders Various common sizes : AA, AAA, 20mm coin cell and 12mm coin cell.
C1-C28 C31 = SparkFun:CAP: Capacitor Standard 0603 ceramic capacitor, and 0.1" leaded capacitor.
C29 = rcl:CPOL-EU: POLARIZED CAPACITOR, European symbol
C30 = SparkFun:CAP_POL: Capacitor Polarized These are standard SMD and PTH capacitors. Normally 10uF, 47uF, and 100uF in electrolytic and tantalum varieties. Always verify the external diameter of the through hole cap, it varies with capacity, voltage, and manufacturer. The EIA devices should be standard.
D3 = SparkFun:LED: LEDs Standard schematic elements and footprints for 5mm, 3mm, 1206, and 0603 sized LEDs. 5mm - Spark Fun Electronics SKU : COM-00529 (and others)
IC1 IC4 = 40xx:4013: Dual D FLIP FLOP, set/reset
IC2 IC3 = 40xx:4093: Quad 2-input NAND schmitt trigger
IC5-IC19 = 74xx-eu:74*595: 8-bit SHIFT REGISTER, output latch
IC20 = linear:LP2950: 100 mA, Low Power Low Dropout Voltage Regulator Source: http://www.onsemi.com/pub/Collateral/LP2950-D.PDF
ISP = SparkFun:M05X2: Header 5x2 Standard 10-pin dual row 0.1" header. Commonly used with AVR-ISP. Use with Spark Fun Electronics SKU: PRT-00778
LED1-LED109 LED112 = led:LED: LED OSRAM: - CHIPLED LG R971, LG N971, LY N971, LG Q971, LY Q971, LO R971, LY R971 LH N974, LH R974 LS Q976, LO Q976, LY Q976 LO Q996 - Hyper CHIPLED LW Q18S LB Q993, LB Q99A, LB R99A - SideLED LS A670, LO A670, LY A670, LG A670, LP A670 LB A673, LV A673, LT A673, LW A673 LH A674 LY A675 LS A676, LA A676, LO A676, LY A676, LW A676 LS A679, LY A679, LG A679 - Hyper Micro SIDELED® LS Y876, LA Y876, LO Y876, LY Y876 LT Y87S - SmartLED LW L88C, LW L88S LB L89C, LB L89S, LG L890 LS L89K, LO L89K, LY L89K LS L896, LA L896, LO L896, LY L896 - TOPLED LS T670, LO T670, LY T670, LG T670, LP T670 LSG T670, LSP T670, LSY T670, LOP T670, LYG T670 LG T671, LOG T671, LSG T671 LB T673, LV T673, LT T673, LW T673 LH T674 LS T676, LA T676, LO T676, LY T676, LB T676, LH T676, LSB T676, LW T676 LB T67C, LV T67C, LT T67C, LS T67K, LO T67K, LY T67K, LW E67C LS E67B, LA E67B, LO E67B, LY E67B, LB E67C, LV E67C, LT E67C LW T67C LS T679, LY T679, LG T679 LS T770, LO T770, LY T770, LG T770, LP T770 LB T773, LV T773, LT T773, LW T773 LH T774 LS E675, LA E675, LY E675, LS T675 LS T776, LA T776, LO T776, LY T776, LB T776 LHGB T686 LT T68C, LB T68C - Hyper Mini TOPLED® LB M676 - Mini TOPLED Santana® LG M470 LS M47K, LO M47K, LY M47K Source: http://www.osram.convergy.de LUXEON: - LUMILED® LXK2-PW12-R00, LXK2-PW12-S00, LXK2-PW14-U00, LXK2-PW14-V00 LXK2-PM12-R00, LXK2-PM12-S00, LXK2-PM14-U00 LXK2-PE12-Q00, LXK2-PE12-R00, LXK2-PE12-S00, LXK2-PE14-T00, LXK2-PE14-U00 LXK2-PB12-K00, LXK2-PB12-L00, LXK2-PB12-M00, LXK2-PB14-N00, LXK2-PB14-P00, LXK2-PB14-Q00 LXK2-PR12-L00, LXK2-PR12-M00, LXK2-PR14-Q00, LXK2-PR14-R00 LXK2-PD12-Q00, LXK2-PD12-R00, LXK2-PD12-S00 LXK2-PH12-R00, LXK2-PH12-S00 LXK2-PL12-P00, LXK2-PL12-Q00, LXK2-PL12-R00 Source: www.luxeon.com KINGBRIGHT: KA-3528ASYC Source: www.kingbright.com
PAD1 PAD2 = wirepad:SMD5: SMD PAD
PAD3-PAD19 = wirepad:SMD2: SMD PAD
Q2 Q3 = crystal:CRYSTAL: CRYSTAL; OC_FARNELL: unknown; OC_NEWARK: unknown
R1-R4 R6-R8 R10 R11 R13-R17 R19-R125 R130 = SparkFun:RESISTOR: Resistor Basic schematic elements and footprints for 0603, 1206, and PTH resistors.
R5 R9 R12 R18 = resistor:R-TRIMM: Trimm resistor
RTC = SparkFun:DS1307
STK500 = SparkFun:M05: Header 5 Standard 5-pin 0.1" header. Use with straight break away headers (SKU : PRT-00116), right angle break away headers (PRT-00553), swiss pins (PRT-00743), machine pins (PRT-00117), and female headers (PRT-00115). Molex polarized connector foot print use with SKU : PRT-08230 with associated crimp pins and housings.
U1 = SparkFun:ATMEGA168

## Net classes
1 supply: width 0.508 mm